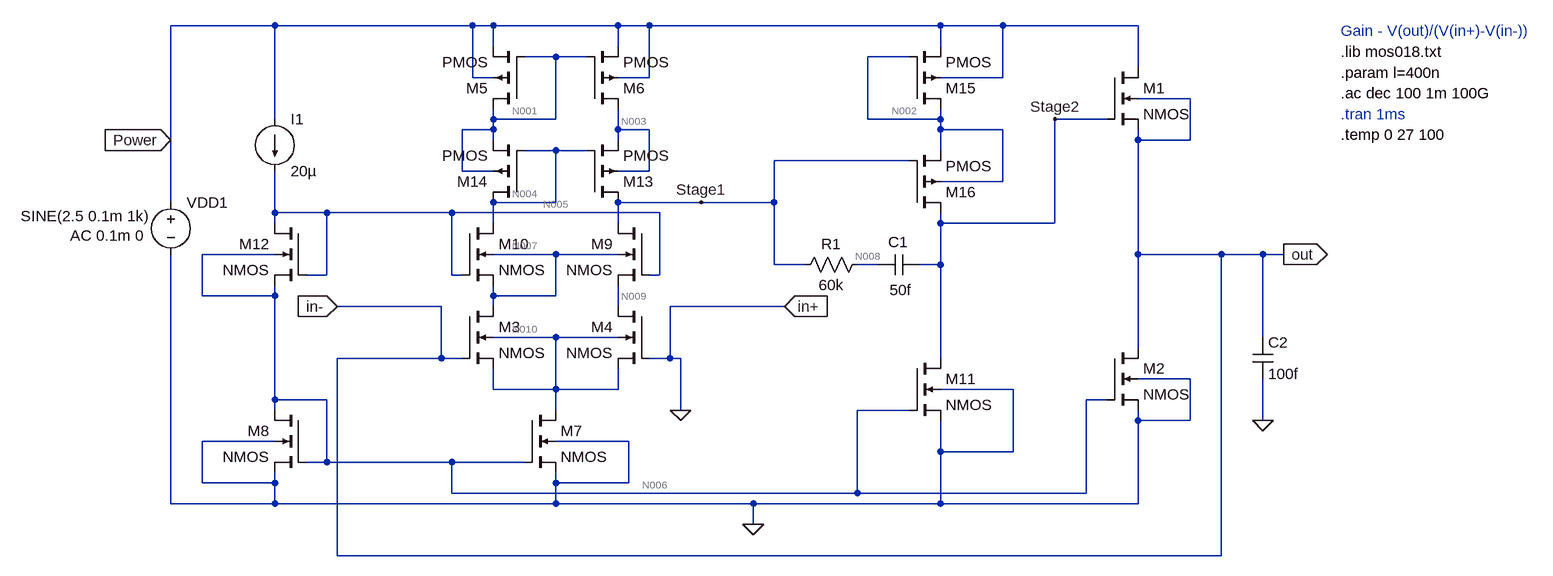
[diagram p0: schematic PSRR.asc]
PSRR.asc, the LTspice schematic file:
Version 4
SHEET 1 1236 680
WIRE -704 -192 -864 -192
WIRE -400 -192 -704 -192
WIRE -368 -192 -400 -192
WIRE -176 -192 -368 -192
WIRE -128 -192 -176 -192
WIRE 320 -192 -128 -192
WIRE 416 -192 320 -192
WIRE 624 -192 416 -192
WIRE -368 -160 -368 -192
WIRE -176 -160 -176 -192
WIRE 320 -160 320 -192
WIRE -272 -144 -320 -144
WIRE -224 -144 -272 -144
WIRE 272 -144 208 -144
WIRE 624 -128 624 -192
WIRE -400 -112 -400 -192
WIRE -368 -112 -400 -112
WIRE -128 -112 -128 -192
WIRE -128 -112 -176 -112
WIRE 416 -112 416 -192
WIRE 416 -112 320 -112
WIRE 704 -80 624 -80
WIRE -704 -48 -704 -192
WIRE -368 -48 -368 -64
WIRE -272 -48 -272 -144
WIRE -272 -48 -368 -48
WIRE 208 -48 208 -144
WIRE 320 -48 320 -64
WIRE 320 -48 208 -48
WIRE 576 -48 496 -48
WIRE -368 -32 -368 -48
WIRE -368 -32 -416 -32
WIRE -176 -32 -176 -64
WIRE -128 -32 -176 -32
WIRE 320 -32 320 -48
WIRE 416 -32 320 -32
WIRE -864 -16 -864 -192
WIRE -368 -16 -368 -32
WIRE -176 -16 -176 -32
WIRE 624 -16 624 -32
WIRE 704 -16 704 -80
WIRE 704 -16 624 -16
WIRE -272 0 -320 0
WIRE -224 0 -272 0
WIRE 320 0 320 -32
WIRE 272 16 64 16
WIRE -416 32 -416 -32
WIRE -368 32 -416 32
WIRE -128 32 -128 -32
WIRE -128 32 -176 32
WIRE 416 48 416 -32
WIRE 416 48 320 48
WIRE -864 80 -864 -16
WIRE -272 80 -272 0
WIRE -272 80 -368 80
WIRE -48 80 -176 80
WIRE 64 80 64 16
WIRE 64 80 -48 80
WIRE -704 96 -704 32
WIRE -624 96 -704 96
WIRE -432 96 -624 96
WIRE -112 96 -432 96
WIRE -704 112 -704 96
WIRE -368 112 -368 80
WIRE -176 112 -176 80
WIRE 320 112 320 96
WIRE 496 112 496 -48
WIRE 496 112 320 112
WIRE -704 160 -816 160
WIRE -272 160 -368 160
WIRE -176 160 -272 160
WIRE 624 160 624 -16
WIRE 752 160 624 160
WIRE 816 160 752 160
WIRE 848 160 816 160
WIRE 64 176 64 80
WIRE 112 176 64 176
WIRE 224 176 192 176
WIRE 320 176 320 112
WIRE 320 176 288 176
WIRE -624 192 -624 96
WIRE -624 192 -656 192
WIRE -432 192 -432 96
WIRE -416 192 -432 192
WIRE -112 192 -112 96
WIRE -112 192 -128 192
WIRE -816 224 -816 160
WIRE -704 224 -704 208
WIRE -704 224 -816 224
WIRE -368 224 -368 208
WIRE -272 224 -272 160
WIRE -272 224 -368 224
WIRE -448 240 -608 240
WIRE -368 240 -368 224
WIRE -176 240 -176 208
WIRE 80 240 -96 240
WIRE -272 288 -368 288
WIRE -176 288 -272 288
WIRE 816 288 816 160
WIRE 624 304 624 160
WIRE -448 320 -448 240
WIRE -448 320 -608 320
WIRE -416 320 -448 320
WIRE -96 320 -96 240
WIRE -96 320 -128 320
WIRE -80 320 -96 320
WIRE 320 320 320 176
WIRE 704 352 624 352
WIRE -368 368 -368 336
WIRE -272 368 -272 288
WIRE -272 368 -368 368
WIRE -176 368 -176 336
WIRE -176 368 -272 368
WIRE 432 368 320 368
WIRE -704 384 -704 224
WIRE -624 384 -704 384
WIRE 576 384 544 384
WIRE -704 400 -704 384
WIRE -272 400 -272 368
WIRE -80 400 -80 320
WIRE 272 400 192 400
WIRE 624 416 624 400
WIRE 704 416 704 352
WIRE 704 416 624 416
WIRE 816 416 816 352
WIRE -704 448 -816 448
WIRE -160 448 -272 448
WIRE 320 464 320 416
WIRE 432 464 432 368
WIRE 432 464 320 464
WIRE -624 480 -624 384
WIRE -624 480 -656 480
WIRE -432 480 -624 480
WIRE -320 480 -432 480
WIRE -816 512 -816 448
WIRE -704 512 -704 496
WIRE -704 512 -816 512
WIRE -272 512 -272 496
WIRE -160 512 -160 448
WIRE -160 512 -272 512
WIRE -432 528 -432 480
WIRE 192 528 192 400
WIRE 192 528 -432 528
WIRE 544 528 544 384
WIRE 544 528 192 528
WIRE -864 544 -864 160
WIRE -704 544 -704 512
WIRE -704 544 -864 544
WIRE -272 544 -272 512
WIRE -272 544 -704 544
WIRE 32 544 -272 544
WIRE 320 544 320 464
WIRE 320 544 32 544
WIRE 624 544 624 416
WIRE 624 544 320 544
WIRE 32 576 32 544
WIRE -608 624 -608 320
WIRE 752 624 752 160
WIRE 752 624 -608 624
FLAG 848 160 out
IOPIN 848 160 Out
FLAG 32 576 0
FLAG 80 240 in+
IOPIN 80 240 In
FLAG -608 240 in-
IOPIN -608 240 In
FLAG -48 80 Stage1
FLAG 496 -48 Stage2
FLAG -864 -16 Power
IOPIN -864 -16 In
FLAG 816 416 0
FLAG -80 400 0
SYMBOL nmos4 576 -128 R0
SYMATTR InstName M1
SYMATTR Value2 l={l} w=0.5u m=20
SYMBOL nmos4 576 304 R0
SYMATTR InstName M2
SYMATTR Value2 l={l} w=10u m=3
SYMBOL nmos4 -416 240 R0
SYMATTR InstName M3
SYMATTR Value2 l={l} w=0.5u m=1
SYMBOL nmos4 -128 240 M0
SYMATTR InstName M4
SYMATTR Value2 l={l} w=0.5u m=1
SYMBOL pmos4 -320 -64 R180
SYMATTR InstName M5
SYMATTR Value2 l={l} w=1u m=2
SYMBOL pmos4 -224 -64 M180
SYMATTR InstName M6
SYMATTR Value2 l={l} w=1u m=2
SYMBOL nmos4 -320 400 R0
SYMATTR InstName M7
SYMATTR Value2 l={l} w=2u
SYMBOL current -704 -48 R0
WINDOW 123 0 0 Left 0
WINDOW 39 0 0 Left 0
SYMATTR InstName I1
SYMATTR Value 20µ
SYMBOL nmos4 -656 400 M0
SYMATTR InstName M8
SYMATTR Value2 l={l} w=10u
SYMBOL voltage -864 64 R0
WINDOW 123 -155 67 Left 2
WINDOW 39 0 0 Left 0
WINDOW 3 -231 37 Left 2
SYMATTR Value2 AC 0.1m 0
SYMATTR Value SINE(2.5 0.1m 1k)
SYMATTR InstName VDD1
SYMBOL nmos4 -128 112 M0
SYMATTR InstName M9
SYMATTR Value2 l={l} w=0.5u m=1
SYMBOL nmos4 -416 112 R0
SYMATTR InstName M10
SYMATTR Value2 l={l} w=0.5u m=1
SYMBOL nmos4 272 320 R0
SYMATTR InstName M11
SYMATTR Value2 l={l} w=1u m=5
SYMBOL cap 288 160 R90
WINDOW 0 -3 33 VBottom 2
WINDOW 3 39 29 VTop 2
SYMATTR InstName C1
SYMATTR Value 50f
SYMBOL nmos4 -656 112 M0
SYMATTR InstName M12
SYMATTR Value2 l={l} w=1u
SYMBOL pmos4 -224 80 M180
SYMATTR InstName M13
SYMATTR Value2 l={l} w=1u m=1
SYMBOL pmos4 -320 80 R180
SYMATTR InstName M14
SYMATTR Value2 l={l} w=1u m=1
SYMBOL pmos4 272 -64 M180
SYMATTR InstName M15
SYMATTR Value2 l={l} w=0.5u m=25
SYMBOL pmos4 272 96 M180
SYMATTR InstName M16
SYMATTR Value2 l={l} w=0.5u m=10
SYMBOL res 208 160 R90
WINDOW 0 0 56 VBottom 2
WINDOW 3 32 56 VTop 2
SYMATTR InstName R1
SYMATTR Value 60k
SYMBOL cap 800 288 R0
SYMATTR InstName C2
SYMATTR Value 100f
TEXT 936 -56 Left 2 ;.tran 1ms
TEXT 936 -24 Left 2 !.temp 0 27 100
TEXT 936 -88 Left 2 !.ac dec 100 1m 100G
TEXT 936 -120 Left 2 !.param l=400n
TEXT 936 -152 Left 2 !.lib mos018.txt
TEXT 936 -184 Left 2 ;Gain - V(out)/(V(in+)-V(in-))

The netlist it stands for:
* PSRR.asc
M1 Power Stage2 in- in- NMOS l={l} w=0.5u m=20
M2 in- N006 0 0 NMOS l={l} w=10u m=3
M3 N007 in- N010 N010 NMOS l={l} w=0.5u m=1
M4 N009 0 N010 N010 NMOS l={l} w=0.5u m=1
M5 N001 N001 Power Power PMOS l={l} w=1u m=2
M6 N003 N001 Power Power PMOS l={l} w=1u m=2
M7 N010 N006 0 0 NMOS l={l} w=2u
I1 Power N005 20µ
M8 N006 N006 0 0 NMOS l={l} w=10u
VDD1 Power 0 SINE(2.5 0.1m 1k) AC 0.1m 0
M9 Stage1 N005 N009 N007 NMOS l={l} w=0.5u m=1
M10 N004 N005 N007 N007 NMOS l={l} w=0.5u m=1
M11 Stage2 N006 0 0 NMOS l={l} w=1u m=5
C1 Stage2 N008 50f
M12 N005 N005 N006 N006 NMOS l={l} w=1u
M13 Stage1 N004 N003 N003 PMOS l={l} w=1u m=1
M14 N004 N004 N001 N001 PMOS l={l} w=1u m=1
M15 N002 N002 Power Power PMOS l={l} w=0.5u m=25
M16 Stage2 Stage1 N002 N002 PMOS l={l} w=0.5u m=10
R1 N008 Stage1 60k
C2 in- 0 100f
.model NMOS NMOS
.model PMOS PMOS
.lib standard.mos
* .tran 1ms
.temp 0 27 100
.ac dec 100 1m 100G
.param l=400n
.lib mos018.txt
* Gain - V(out)/(V(in+)-V(in-))
.backanno
.end

* Results of the author's LTspice run, read from the files saved beside the schematic
* Operating Point (first step), zero values left out:
*   V(power) = 2.5 V
*   V(stage2) = 6.757 mV
*   V(in-) = 63.75 nV
*   V(n006) = 517.6 mV
*   V(n007) = 1.211 V
*   V(n010) = 45.5 nV
*   V(n009) = 1.173 V
*   V(n001) = 2.479 V
*   V(n003) = 2.46 V
*   V(n005) = 1.194 V
*   V(stage1) = 1.612 V
*   V(n004) = 2.443 V
*   V(n008) = 1.612 V
*   V(n002) = 2.07 V
*   Id(M16) = -1.58 µA
*   Ib(M16) = 20.73 pA
*   Is(M16) = 1.58 µA
*   Id(M15) = -1.58 µA
*   Ib(M15) = 11.01 pA
*   Is(M15) = 1.58 µA
*   Id(M14) = -1.782 pA
*   Is(M14) = 1.738 pA
*   Id(M13) = -2.399 pA
*   Is(M13) = 1.541 pA
*   Id(M6) = -2.399 pA
*   Is(M6) = 2.303 pA
*   Id(M5) = -1.782 pA
*   Is(M5) = 1.728 pA
*   Id(M12) = 20 µA
*   Is(M12) = -20 µA
*   Id(M11) = 1.58 µA
*   Is(M11) = -1.58 µA
*   Id(M10) = 1.782 pA
*   Ib(M10) = -1.242 pA
*   Id(M9) = 2.399 pA
*   Is(M9) = -2.066 pA
*   Id(M8) = 20 µA
*   Is(M8) = -20 µA
*   Id(M7) = 4.181 pA
*   Is(M7) = -4.181 pA
*   Id(M4) = 2.066 pA
*   Ib(M4) = -1.183 pA
*   Id(M3) = 2.115 pA
*   Ib(M3) = -1.221 pA
*   Id(M2) = 82.88 pA
*   Is(M2) = -82.88 pA
*   Id(M1) = 82.88 pA
*   Ib(M1) = -50.2 pA
*   Is(M1) = -32.68 pA
*   I(I1) = 20 µA
*   I(Vdd1) = -21.58 µA